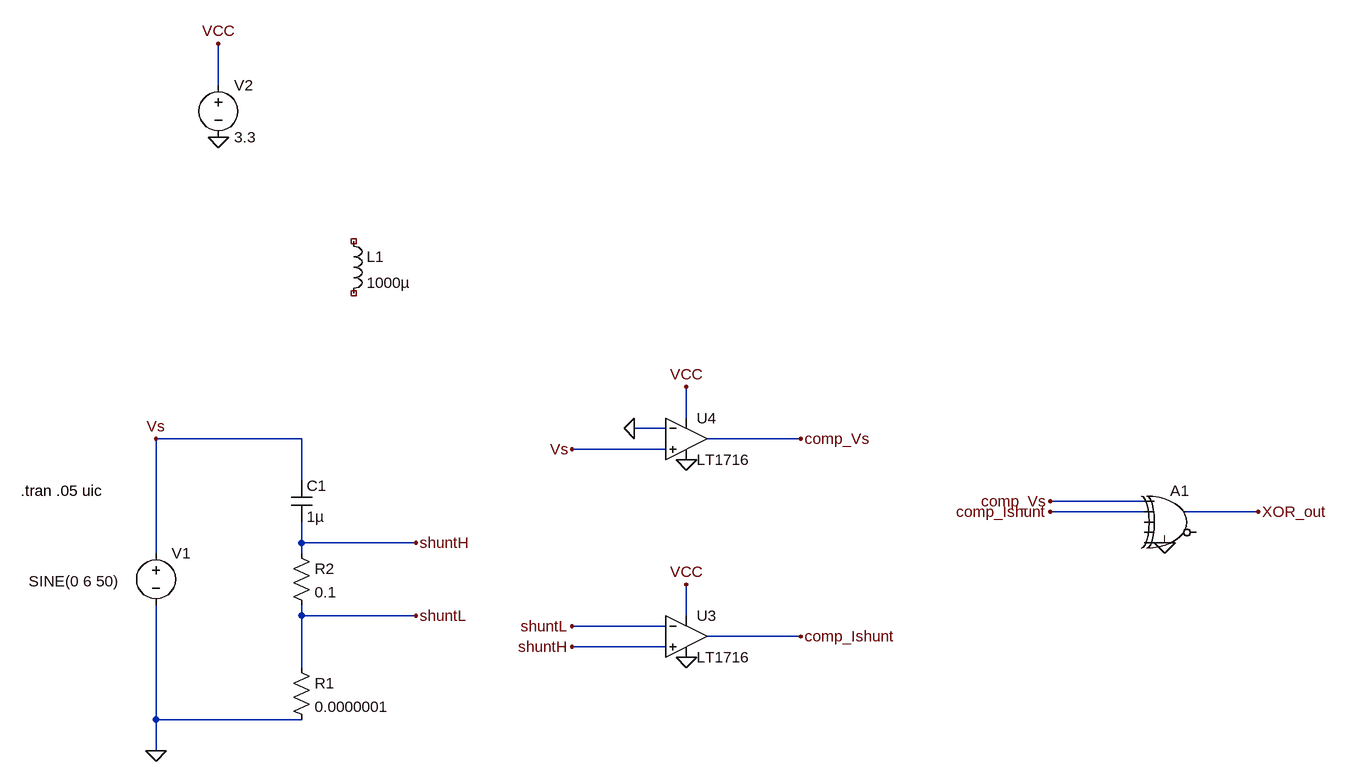
[diagram p0: schematic phase detection.asc]
phase detection.asc, the LTspice schematic file:
Version 4.1
SHEET 1 1880 680
WIRE 160 -608 160 -672
WIRE 880 -96 880 -144
WIRE 848 -80 800 -80
WIRE 288 -64 64 -64
WIRE 1056 -64 912 -64
WIRE 848 -48 704 -48
WIRE 288 0 288 -64
WIRE 1584 32 1440 32
WIRE 1584 48 1440 48
WIRE 1760 48 1648 48
WIRE 288 96 288 64
WIRE 464 96 288 96
WIRE 64 112 64 -64
WIRE 288 112 288 96
WIRE 288 208 288 192
WIRE 464 208 288 208
WIRE 880 208 880 160
WIRE 848 224 704 224
WIRE 1056 240 912 240
WIRE 848 256 704 256
WIRE 288 288 288 208
WIRE 64 368 64 192
WIRE 288 368 64 368
WIRE 64 416 64 368
FLAG 64 416 0
FLAG 64 -64 Vs
FLAG 464 96 shuntH
FLAG 880 272 0
FLAG 160 -528 0
FLAG 1056 240 comp_Ishunt
FLAG 160 -672 VCC
FLAG 880 160 VCC
FLAG 1616 96 0
FLAG 800 -80 0
FLAG 880 -32 0
FLAG 880 -144 VCC
FLAG 704 -48 Vs
FLAG 1056 -64 comp_Vs
FLAG 1440 32 comp_Vs
FLAG 1440 48 comp_Ishunt
FLAG 1760 48 XOR_out
FLAG 464 208 shuntL
FLAG 704 224 shuntL
FLAG 704 256 shuntH
SYMBOL voltage 64 96 R0
WINDOW 3 -196 59 Left 2
WINDOW 123 0 0 Left 0
WINDOW 39 0 0 Left 0
SYMATTR Value SINE(0 6 50)
SYMATTR InstName V1
SYMBOL ind 352 -384 R0
SYMATTR InstName L1
SYMATTR Value 1000µ
SYMBOL cap 272 0 R0
SYMATTR InstName C1
SYMATTR Value 1µ
SYMBOL res 272 96 R0
SYMATTR InstName R2
SYMATTR Value 0.1
SYMBOL voltage 160 -624 R0
WINDOW 123 0 0 Left 0
WINDOW 39 0 0 Left 0
SYMATTR InstName V2
SYMATTR Value 3.3
SYMBOL Digital\\xor 1632 0 R0
SYMATTR InstName A1
SYMBOL Comparators\\LT1716 880 240 R0
SYMATTR InstName U3
SYMBOL Comparators\\LT1716 880 -64 R0
SYMATTR InstName U4
SYMBOL res 272 272 R0
SYMATTR InstName R1
SYMATTR Value 0.0000001
TEXT -144 16 Left 2 !.tran .05 uic

The netlist it stands for:
* phase detection.asc
V1 Vs 0 SINE(0 6 50)
L1 NC_01 NC_02 1000µ
C1 Vs shuntH 1µ
R2 shuntH shuntL 0.1
V2 VCC 0 3.3
A1 comp_Vs comp_Ishunt 0 0 0 0 XOR_out 0 XOR
X§U3 shuntH shuntL VCC 0 comp_Ishunt LT1716  ; pins In+ In- V+ V- OUT
X§U4 Vs 0 VCC 0 comp_Vs LT1716  ; pins In+ In- V+ V- OUT
R1 shuntL 0 0.0000001
.tran .05 uic
.lib LTC1.lib
.backanno
.end